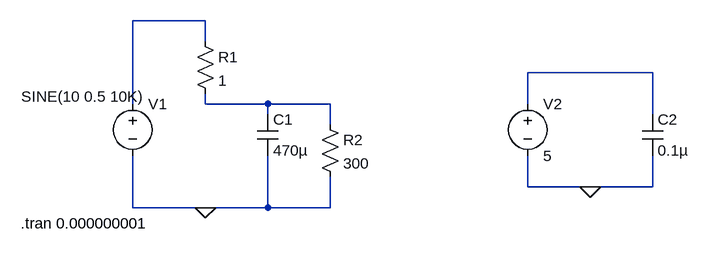
[diagram p0: schematic Low_Pass_Filters.asc]
Low_Pass_Filters.asc, the LTspice schematic file:
Version 4
SHEET 1 880 680
WIRE 96 0 -16 0
WIRE 96 32 96 0
WIRE 784 80 592 80
WIRE -16 128 -16 0
WIRE 96 128 96 112
WIRE 192 128 96 128
WIRE 288 128 192 128
WIRE 592 128 592 80
WIRE 192 144 192 128
WIRE 784 144 784 80
WIRE 288 160 288 128
WIRE 592 256 592 208
WIRE 688 256 592 256
WIRE 784 256 784 208
WIRE 784 256 688 256
WIRE -16 288 -16 208
WIRE 96 288 -16 288
WIRE 192 288 192 208
WIRE 192 288 96 288
WIRE 288 288 288 240
WIRE 288 288 192 288
FLAG 96 288 0
FLAG 688 256 0
SYMBOL cap 176 144 R0
SYMATTR InstName C1
SYMATTR Value 470µ
SYMATTR SpiceLine IC=0
SYMBOL voltage -16 112 R0
WINDOW 3 -171 5 Left 2
WINDOW 123 0 0 Left 0
WINDOW 39 0 0 Left 0
SYMATTR InstName V1
SYMATTR Value SINE(10 0.5 10K)
SYMBOL res 80 16 R0
SYMATTR InstName R1
SYMATTR Value 1
SYMBOL res 272 144 R0
SYMATTR InstName R2
SYMATTR Value 300
SYMBOL voltage 592 112 R0
SYMATTR InstName V2
SYMATTR Value 5
SYMBOL cap 768 144 R0
SYMATTR InstName C2
SYMATTR Value 0.1µ
SYMATTR SpiceLine IC=0
TEXT -188 312 Left 2 !.tran 0.000000001

The netlist it stands for:
* Low_Pass_Filters.asc
C1 N003 0 470µ IC=0
V1 N001 0 SINE(10 0.5 10K)
R1 N001 N003 1
R2 N003 0 300
V2 N002 0 5
C2 N002 0 0.1µ IC=0
.tran 0.000000001
.backanno
.end